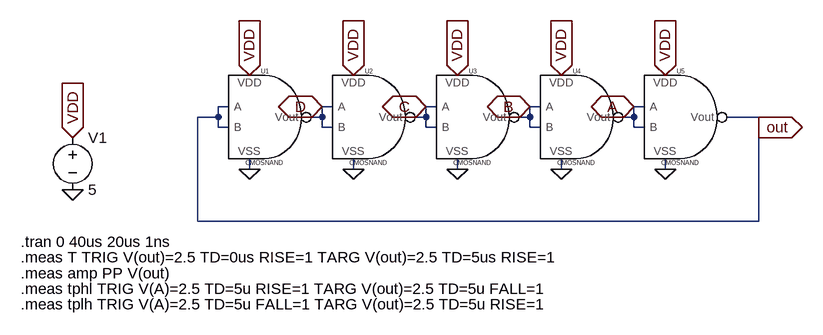
[diagram p0: schematic part_23.asc]
part_23.asc, the LTspice schematic file:
Version 4
SHEET 1 1612 680
WIRE 720 48 704 48
WIRE 880 48 864 48
WIRE 1040 48 1024 48
WIRE 1200 48 1184 48
WIRE 1360 48 1344 48
WIRE 704 64 704 48
WIRE 704 64 672 64
WIRE 864 64 864 48
WIRE 864 64 848 64
WIRE 1024 64 1024 48
WIRE 1024 64 1008 64
WIRE 1184 64 1184 48
WIRE 1184 64 1168 64
WIRE 1344 64 1344 48
WIRE 1344 64 1328 64
WIRE 1536 64 1488 64
WIRE 704 80 704 64
WIRE 720 80 704 80
WIRE 864 80 864 64
WIRE 880 80 864 80
WIRE 1024 80 1024 64
WIRE 1040 80 1024 80
WIRE 1184 80 1184 64
WIRE 1200 80 1184 80
WIRE 1344 80 1344 64
WIRE 1360 80 1344 80
WIRE 1536 80 1536 64
WIRE 752 144 752 128
WIRE 912 144 912 128
WIRE 1072 144 1072 128
WIRE 1232 144 1232 128
WIRE 1392 144 1392 128
WIRE 672 224 672 64
WIRE 1536 224 1536 80
WIRE 1536 224 672 224
FLAG 480 176 0
FLAG 480 96 VDD
IOPIN 480 96 In
FLAG 752 0 VDD
IOPIN 752 0 In
FLAG 912 0 VDD
IOPIN 912 0 In
FLAG 1072 0 VDD
IOPIN 1072 0 In
FLAG 1232 0 VDD
IOPIN 1232 0 In
FLAG 1392 0 VDD
IOPIN 1392 0 In
FLAG 752 144 0
FLAG 912 144 0
FLAG 1072 144 0
FLAG 1232 144 0
FLAG 1392 144 0
FLAG 1536 80 out
IOPIN 1536 80 Out
FLAG 1344 48 A
IOPIN 1344 48 BiDir
FLAG 1184 48 B
IOPIN 1184 48 BiDir
FLAG 1024 48 C
IOPIN 1024 48 BiDir
FLAG 864 48 D
IOPIN 864 48 BiDir
SYMBOL voltage 480 80 R0
WINDOW 123 0 0 Left 0
WINDOW 39 0 0 Left 0
SYMATTR InstName V1
SYMATTR Value 5
SYMBOL AutoGenerated\\CMOSNAND 768 64 R0
SYMATTR InstName U1
SYMBOL AutoGenerated\\CMOSNAND 928 64 R0
SYMATTR InstName U2
SYMBOL AutoGenerated\\CMOSNAND 1088 64 R0
SYMATTR InstName U3
SYMBOL AutoGenerated\\CMOSNAND 1248 64 R0
SYMATTR InstName U4
SYMBOL AutoGenerated\\CMOSNAND 1408 64 R0
SYMATTR InstName U5
TEXT 400 256 Left 2 !.tran 0 40us 20us 1ns
TEXT 400 280 Left 2 !.meas T TRIG V(out)=2.5 TD=0us RISE=1 TARG V(out)=2.5 TD=5us RISE=1
TEXT 400 304 Left 2 !.meas amp PP V(out)
TEXT 400 328 Left 2 !.meas tphl TRIG V(A)=2.5 TD=5u RISE=1 TARG V(out)=2.5 TD=5u FALL=1
TEXT 400 352 Left 2 !.meas tplh TRIG V(A)=2.5 TD=5u FALL=1 TARG V(out)=2.5 TD=5u RISE=1

The netlist it stands for:
* part_23.asc
V1 VDD 0 5
XU1 D out out VDD 0 CMOSNAND  ; pins Vout A B VDD VSS
XU2 C D D VDD 0 CMOSNAND  ; pins Vout A B VDD VSS
XU3 B C C VDD 0 CMOSNAND  ; pins Vout A B VDD VSS
XU4 A B B VDD 0 CMOSNAND  ; pins Vout A B VDD VSS
XU5 out A A VDD 0 CMOSNAND  ; pins Vout A B VDD VSS
.tran 0 40us 20us 1ns
.meas T TRIG V(out)=2.5 TD=0us RISE=1 TARG V(out)=2.5 TD=5us RISE=1
.meas amp PP V(out)
.meas tphl TRIG V(A)=2.5 TD=5u RISE=1 TARG V(out)=2.5 TD=5u FALL=1
.meas tplh TRIG V(A)=2.5 TD=5u FALL=1 TARG V(out)=2.5 TD=5u RISE=1
.lib .\CMOSNAND.lib
.backanno
.end

* Results of the author's LTspice run, read from the files saved beside the schematic
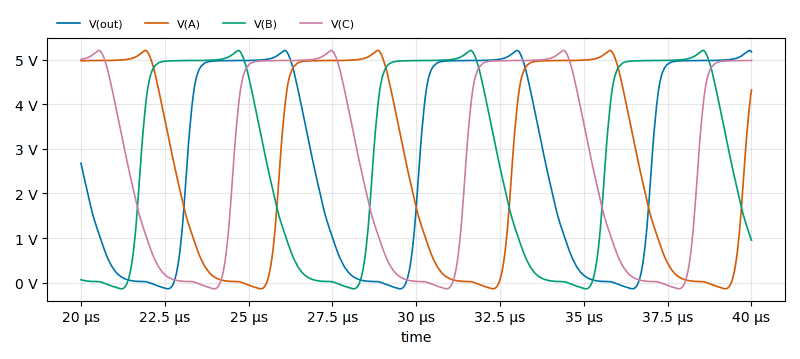
[diagram p1: Transient Analysis of part_23.asc, plotted from the saved traces]
* Transient Analysis, 1 run:
*   V(out): min -138.4 mV, max 5.206 V, average 2.75 V, rms 3.529 V, last 5.172 V
*   V(A): min -138.5 mV, max 5.206 V, average 2.718 V, rms 3.491 V, last 4.318 V
*   V(B): min -138.5 mV, max 5.206 V, average 2.895 V, rms 3.622 V, last 951.3 mV
*   V(C): min -138.4 mV, max 5.206 V, average 2.713 V, rms 3.485 V, last 4.98 V